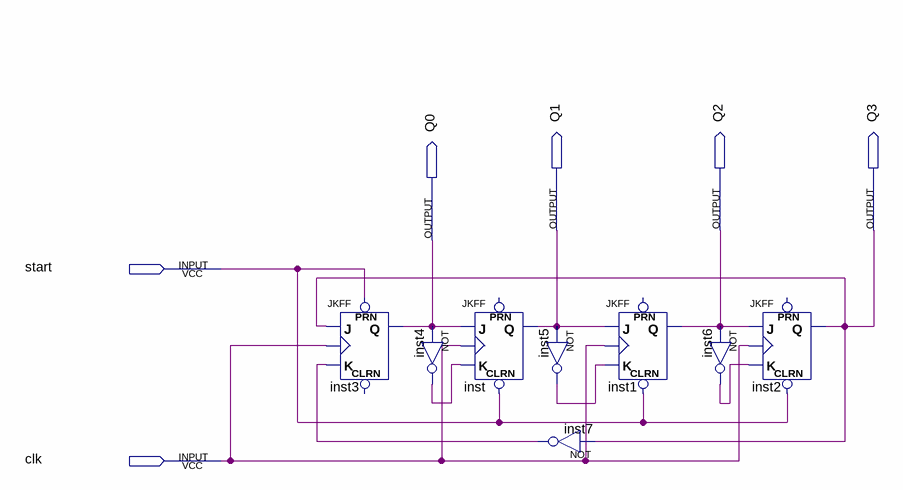
[diagram p0: schematic sheet]
// Quartus schematic HW09.bdf as structural Verilog: 8 symbols, 6 pins
module HW09 (
  input  start,
  input  clk,
  output Q1,
  output Q2,
  output Q3,
  output Q0
);

  wire inst4_out, inst5_out, inst6_out, inst7_out;

  JKFF inst3 (.PRN(start), .K(inst7_out), .J(Q3), .CLK(clk), .Q(Q0));  // open: CLRN
  JKFF inst (.CLRN(start), .K(inst4_out), .J(Q0), .CLK(clk), .Q(Q1));  // open: PRN
  not inst4 (inst4_out, Q0);
  not inst5 (inst5_out, Q1);
  not inst7 (inst7_out, Q3);
  JKFF inst1 (.CLRN(start), .K(inst5_out), .J(Q1), .CLK(clk), .Q(Q2));  // open: PRN
  not inst6 (inst6_out, Q2);
  JKFF inst2 (.CLRN(start), .K(inst6_out), .J(Q2), .CLK(clk), .Q(Q3));  // open: PRN
endmodule
